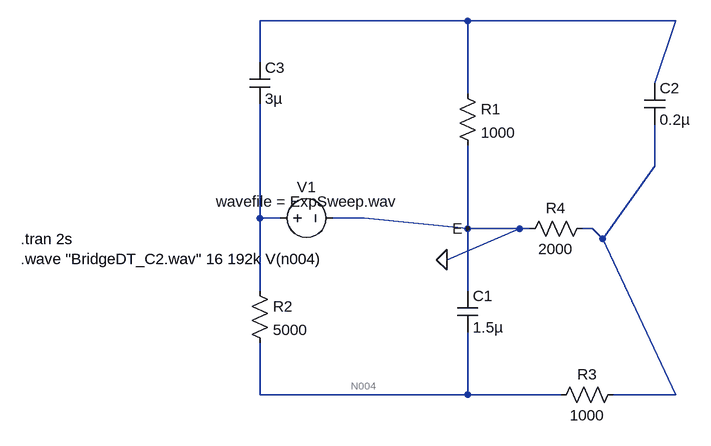
[diagram p0: schematic Twin T.asc]
Twin T.asc, the LTspice schematic file:
Version 4
SHEET 1 880 680
WIRE 432 32 112 32
WIRE 752 32 432 32
WIRE 112 96 112 32
WIRE 720 128 752 32
WIRE 432 144 432 32
WIRE 720 256 720 192
WIRE 112 336 112 160
WIRE 144 336 112 336
WIRE 272 336 224 336
WIRE 432 352 432 224
WIRE 432 352 272 336
WIRE 512 352 432 352
WIRE 528 352 512 352
WIRE 624 352 608 352
WIRE 640 368 720 256
WIRE 640 368 624 352
WIRE 400 400 512 352
WIRE 112 448 112 336
WIRE 432 448 432 352
WIRE 112 608 112 528
WIRE 432 608 432 512
WIRE 432 608 112 608
WIRE 576 608 432 608
WIRE 752 608 640 368
WIRE 752 608 656 608
FLAG 400 400 0
FLAG 432 352 E
SYMBOL cap 704 128 R0
SYMATTR InstName C2
SYMATTR Value 0.2µ
SYMBOL cap 96 96 R0
SYMATTR InstName C3
SYMATTR Value 3µ
SYMBOL cap 416 448 R0
SYMATTR InstName C1
SYMATTR Value 1.5µ
SYMBOL res 416 128 R0
SYMATTR InstName R1
SYMATTR Value 1000
SYMBOL res 96 432 R0
SYMATTR InstName R2
SYMATTR Value 5000
SYMBOL res 672 592 R90
WINDOW 0 0 56 VBottom 2
WINDOW 3 32 56 VTop 2
SYMATTR InstName R3
SYMATTR Value 1000
SYMBOL voltage 128 336 R270
WINDOW 0 32 56 VTop 2
WINDOW 3 10 56 VTop 2
SYMATTR InstName V1
SYMATTR Value wavefile = ExpSweep.wav
SYMBOL res 512 368 R270
WINDOW 0 32 56 VTop 2
WINDOW 3 0 56 VBottom 2
SYMATTR InstName R4
SYMATTR Value 2000
TEXT -256 368 Left 2 !.tran 2s\n.wave "BridgeDT_C2.wav" 16 192k V(n004)

The netlist it stands for:
* Twin T.asc
C2 N001 N002 0.2µ
C3 N001 N003 3µ
C1 0 N004 1.5µ
R1 N001 0 1000
R2 N003 N004 5000
R3 N002 N004 1000
V1 N003 0 wavefile = ExpSweep.wav
R4 0 N002 2000
.tran 2s
.wave "BridgeDT_C2.wav" 16 192k V(n004)
.backanno
.end